# Altium schematic sheet Buton_Unit.SchDoc
size A4; SheetNumber: 1; SheetTotal: 1
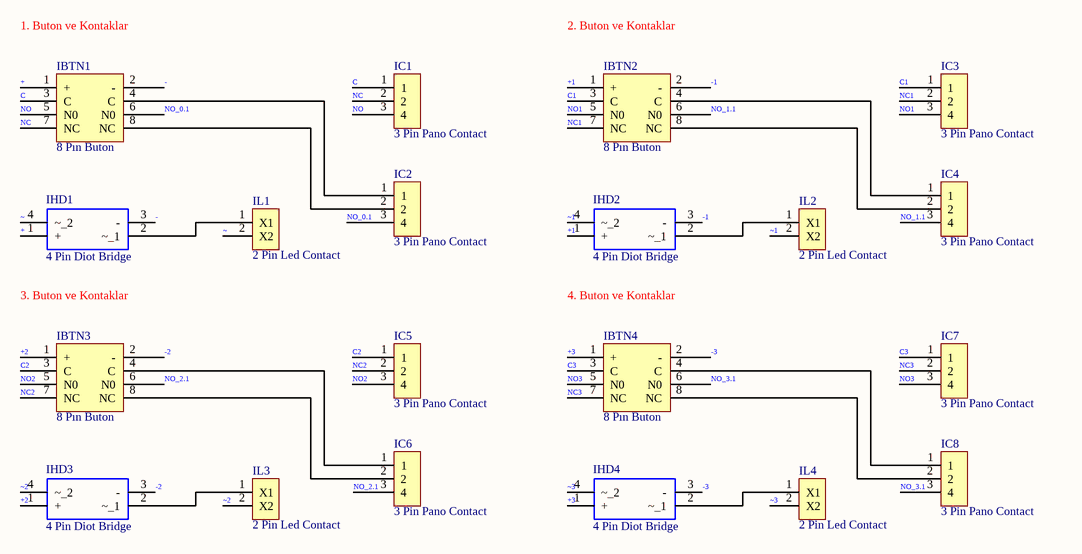
[diagram p0: Buton_Unit.SchDoc]

## Parts
IBTN1  8 Pın Buton  [8_Pin_Buton]
IBTN2  8 Pın Buton  [8_Pin_Buton]
IBTN3  8 Pın Buton  [8_Pin_Buton]
IBTN4  8 Pın Buton  [8_Pin_Buton]
IC1  3 Pin Pano Contact  [Contact]
IC2  3 Pin Pano Contact  [Contact]
IC3  3 Pin Pano Contact  [Contact]
IC4  3 Pin Pano Contact  [Contact]
IC5  3 Pin Pano Contact  [Contact]
IC6  3 Pin Pano Contact  [Contact]
IC7  3 Pin Pano Contact  [Contact]
IC8  3 Pin Pano Contact  [Contact]
IHD1  4 Pin Diot Bridge  [W10M]
IHD2  4 Pin Diot Bridge  [W10M]
IHD3  4 Pin Diot Bridge  [W10M]
IHD4  4 Pin Diot Bridge  [W10M]
IL1  2 Pin Led Contact  [LED_Contact]
IL2  2 Pin Led Contact  [LED_Contact]
IL3  2 Pin Led Contact  [LED_Contact]
IL4  2 Pin Led Contact  [LED_Contact]

## Nets
+: IBTN1.1(+) IHD1.1(+)
+1: IBTN2.1(+) IHD2.1(+)
+2: IBTN3.1(+) IHD3.1(+)
+3: IBTN4.1(+) IHD4.1(+)
-: IBTN1.2(-) IHD1.3(-)
-1: IBTN2.2(-) IHD2.3(-)
-2: IBTN3.2(-) IHD3.3(-)
-3: IBTN4.2(-) IHD4.3(-)
C: IBTN1.3(C) IC1.1
C1: IBTN2.3(C) IC3.1
C2: IBTN3.3(C) IC5.1
C3: IBTN4.3(C) IC7.1
NC: IBTN1.7(NC) IC1.2
NC1: IBTN2.7(NC) IC3.2
NC2: IBTN3.7(NC) IC5.2
NC3: IBTN4.7(NC) IC7.2
NO: IBTN1.5(N0) IC1.3(4)
NO1: IBTN2.5(N0) IC3.3(4)
NO2: IBTN3.5(N0) IC5.3(4)
NO3: IBTN4.5(N0) IC7.3(4)
NO_0.1: IBTN1.6(N0) IC2.3(4)
NO_1.1: IBTN2.6(N0) IC4.3(4)
NO_2.1: IBTN3.6(N0) IC6.3(4)
NO_3.1: IBTN4.6(N0) IC8.3(4)
~: IHD1.4(~_2) IL1.2(X2)
~1: IHD2.4(~_2) IL2.2(X2)
~2: IHD3.4(~_2) IL3.2(X2)
~3: IHD4.4(~_2) IL4.2(X2)
NetIBTN1_4: IBTN1.4(C) IC2.1
NetIBTN1_8: IBTN1.8(NC) IC2.2
NetIBTN2_4: IBTN2.4(C) IC4.1
NetIBTN2_8: IBTN2.8(NC) IC4.2
NetIBTN3_4: IBTN3.4(C) IC6.1
NetIBTN3_8: IBTN3.8(NC) IC6.2
NetIBTN4_4: IBTN4.4(C) IC8.1
NetIBTN4_8: IBTN4.8(NC) IC8.2
NetIHD1_2: IHD1.2(~_1) IL1.1(X1)
NetIHD2_2: IHD2.2(~_1) IL2.1(X1)
NetIHD3_2: IHD3.2(~_1) IL3.1(X1)
NetIHD4_2: IHD4.2(~_1) IL4.1(X1)

## Notes on the sheet
- 1. Buton ve Kontaklar
- 2. Buton ve Kontaklar
- 3. Buton ve Kontaklar
- 4. Buton ve Kontaklar

## Library data of the parts
IBTN1-IBTN4 = PBL16_AC_DC 24V_IP65
IC1-IC8 = Contact
IHD1-IHD4 = W10M
IL1-IL4 = LED_Contact